# Altium schematic sheet projet_pcb_naked_f103.SchDoc
size A2
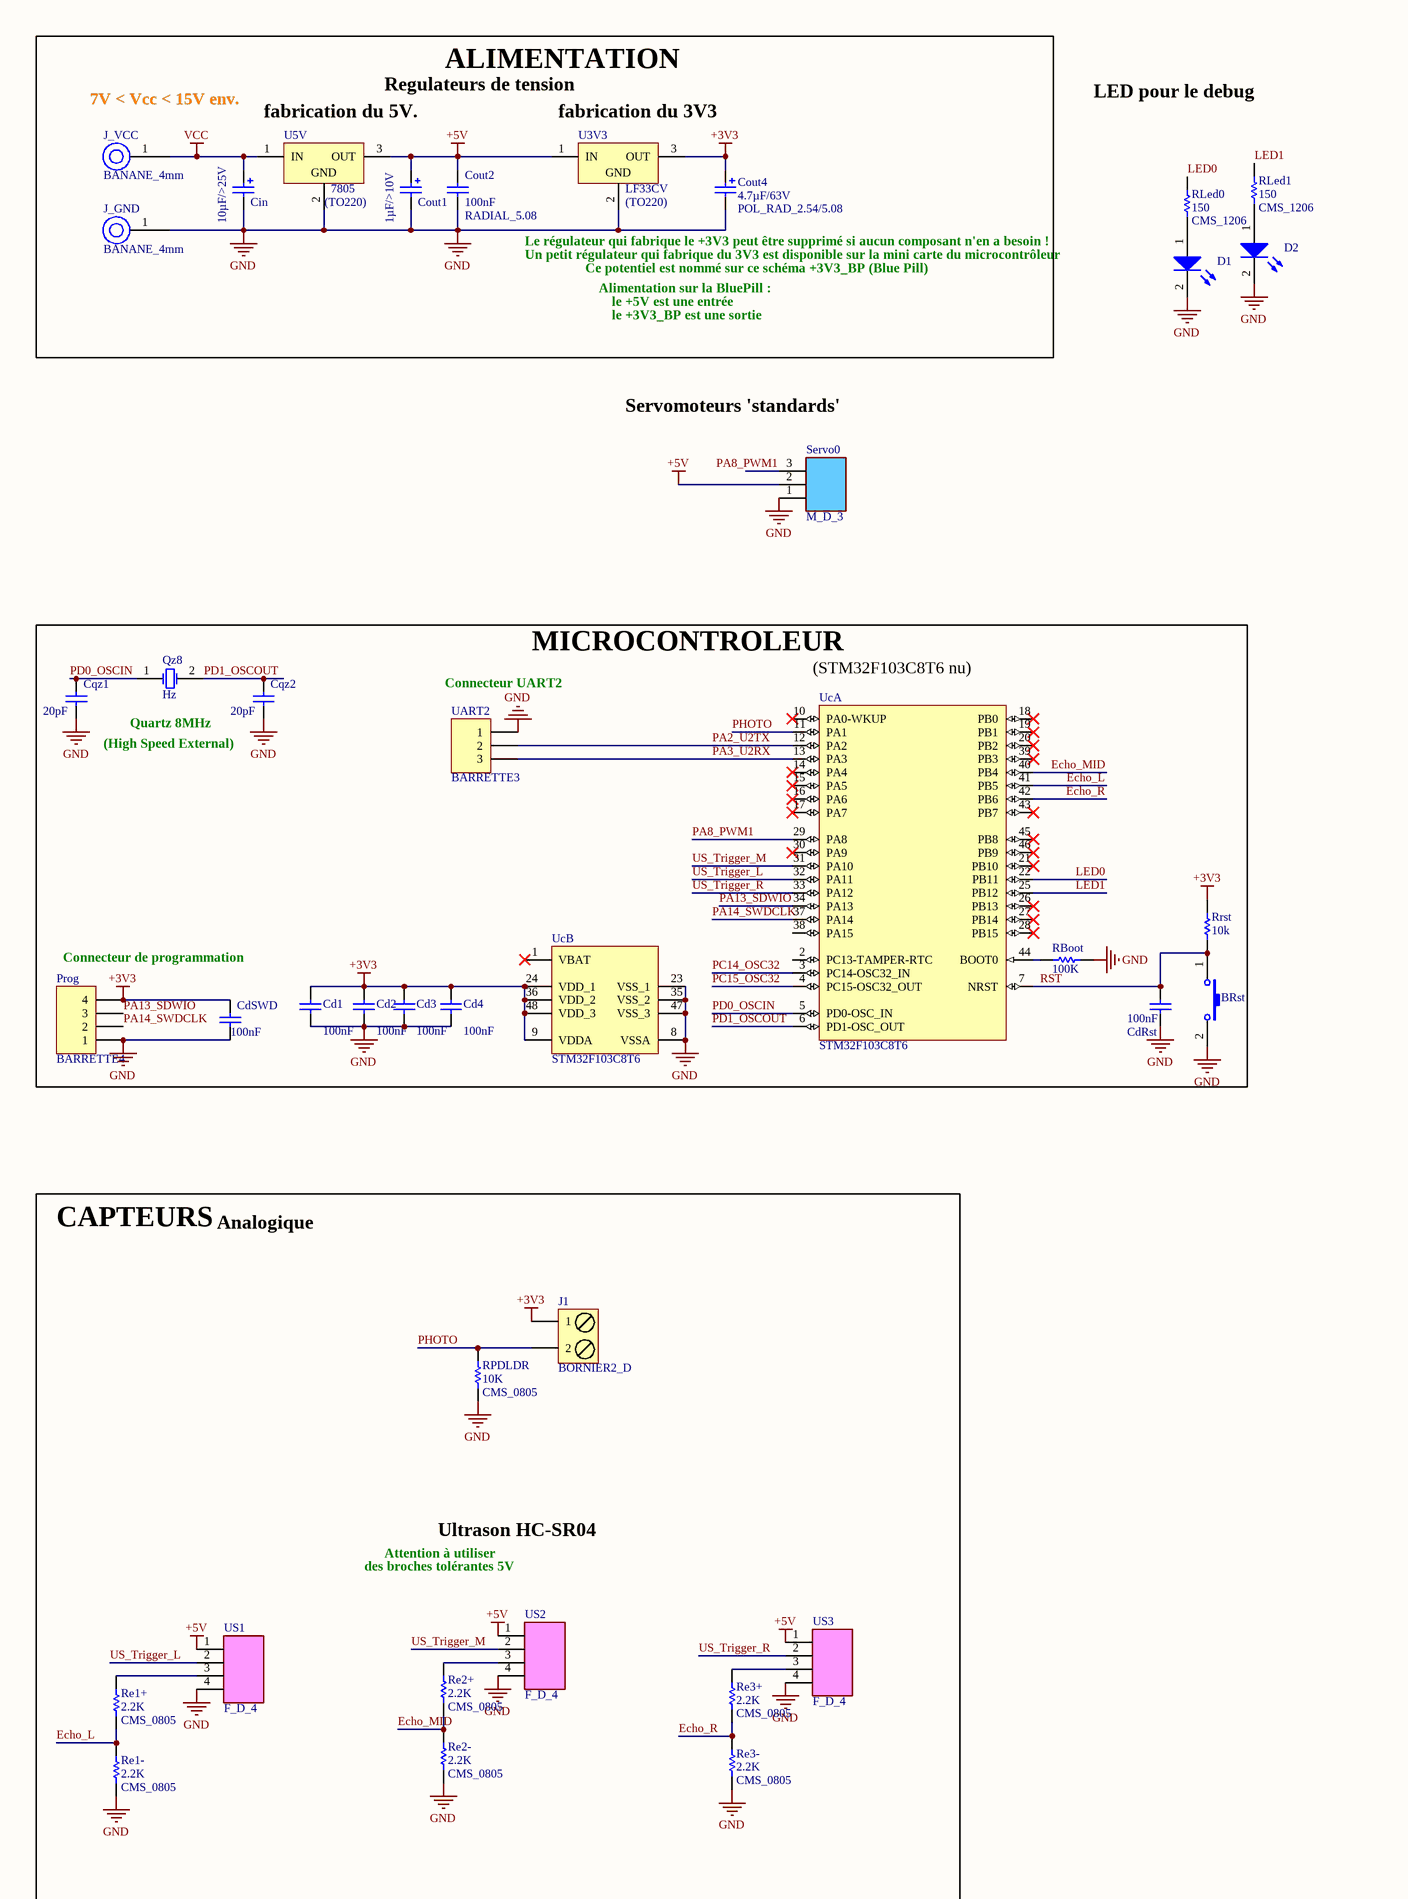
[diagram p0: projet_pcb_naked_f103.SchDoc, left]
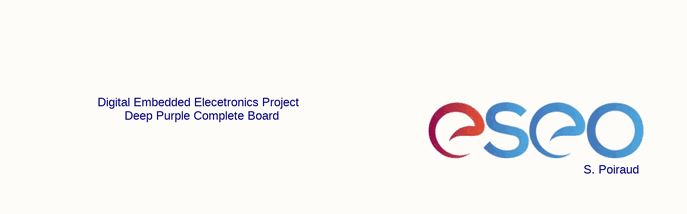
[diagram p1: projet_pcb_naked_f103.SchDoc, right]

## Parts
BRst  BOUTON_POUSSOIR_MINIATURE_TRAVERSANT  [BOUTON_POUSSE_PLAT_6x6]  (value not drawn)
Cd1  value 100nF  [CONDENSATEUR_CMS_0805]  (hidden comment: CMS_0805)
Cd2  value 100nF  [CONDENSATEUR_CMS_0805]  (hidden comment: CMS_0805)
Cd3  value 100nF  [CONDENSATEUR_CMS_0805]  (hidden comment: CMS_0805)
Cd4  value 100nF  [CONDENSATEUR_CMS_0805]  (hidden comment: CMS_0805)
CdRst  value 100nF  [C0805_N]  (hidden comment: Condensateur 0805)
CdSWD  value 100nF  [C0805_N]  (hidden comment: Condensateur 0805)
Cin  value 10µF/>25V  [CONDENSATEUR_POLARISE_ELECTROLYTIQUE_RADIAL_2.0/5.08]  (hidden comment: CONDENSATEUR_POL_ELECTROLY_RAD_2.0/5.08)
Cout1  value 1µF/>10V  [CONDENSATEUR_POLARISE_ELECTROLYTIQUE_RADIAL_2.0/5.08]  (hidden comment: CONDENSATEUR_POL_ELECTROLY_RAD_2.0/5.08)
Cout2  value 100nF  Type: RADIAL_5.08  [CONDENSATEUR_CERAMIQUE_RADIAL_5.08]  (hidden comment: CONDENSATEUR_CER_RAD_5.08)
Cout4  value 4.7µF/63V  Type: POL_RAD_2.54/5.08  [CONDENSATEUR_POLARISE_ELECTROLYTIQUE_RADIAL_2.54/5.08]  (hidden comment: CONDENSATEUR_POL_ELECTROLY_RAD_2.54/5.08)
Cqz1  value 20pF  [C0805_N]  (hidden comment: Condensateur 0805)
Cqz2  value 20pF  [C0805_N]  (hidden comment: Condensateur 0805)
D1  LED_CMS_0805  [LED_CMS_0805]  (value not drawn)
D2  LED_CMS_0805  [LED_CMS_0805]  (value not drawn)
J1  Type: BORNIER2_D  [BORNIER2_A_VIS]  (hidden comment: BORNIER2 DROIT A VIS)
J_GND  Type: BANANE_4mm  [DOUILLE_BANANE_4mm]  (hidden comment: DOUILLE BANANE 4mm)
J_VCC  Type: BANANE_4mm  [DOUILLE_BANANE_4mm]  (hidden comment: DOUILLE BANANE 4mm)
Prog  BARRETTE4  [HE14_4]
Qz8  Hz  [HC49/4H_SMX]
RBoot  value 100K  [RESISTANCE_CMS_0805]  (hidden comment: RESISTANCE_CMS_0805)
Re1+  value 2.2K  Type: CMS_0805  [RESISTANCE_CMS_0805]  (hidden comment: RESISTANCE_CMS_0805)
Re1-  value 2.2K  Type: CMS_0805  [RESISTANCE_CMS_0805]  (hidden comment: RESISTANCE_CMS_0805)
Re2+  value 2.2K  Type: CMS_0805  [RESISTANCE_CMS_0805]  (hidden comment: RESISTANCE_CMS_0805)
Re2-  value 2.2K  Type: CMS_0805  [RESISTANCE_CMS_0805]  (hidden comment: RESISTANCE_CMS_0805)
Re3+  value 2.2K  Type: CMS_0805  [RESISTANCE_CMS_0805]  (hidden comment: RESISTANCE_CMS_0805)
Re3-  value 2.2K  Type: CMS_0805  [RESISTANCE_CMS_0805]  (hidden comment: RESISTANCE_CMS_0805)
RLed0  value 150  Type: CMS_1206  [RESISTANCE_CMS_1206]  (hidden comment: RESISTANCE_CMS_1206)
RLed1  value 150  Type: CMS_1206  [RESISTANCE_CMS_1206]  (hidden comment: RESISTANCE_CMS_1206)
RPDLDR  value 10K  Type: CMS_0805  [RESISTANCE_CMS_0805]  (hidden comment: RESISTANCE_CMS_0805)
Rrst  10k  [R1206_N]
Servo0  Type: M_D_3  [BARRETTE_3_M_D]  (hidden comment: BARRETTE 3 CONTACTS 1 RANGEE MALE DROITE)
U3V3  Type: LF33CV  Package: (TO220)  [REGULATEUR_TO220_78XX]  (hidden comment: REGULATEUR_TO220_78XX)
U5V  Type: 7805  Package: (TO220)  [REGULATEUR_TO220_78XX]  (hidden comment: REGULATEUR_TO220_78XX)
UART2  BARRETTE3  [HDR1X3]
Uc  STM32F103C8T6  [STM-LQFP48_N]  (parts A,B of 2)
US1  Type: F_D_4  [BARRETTE_4_F_D]  (hidden comment: BARRETTE_4 CONTACTS_1 RANGEE_FEMELLE_DROITE)
US2  Type: F_D_4  [BARRETTE_4_F_D]  (hidden comment: BARRETTE_4 CONTACTS_1 RANGEE_FEMELLE_DROITE)
US3  Type: F_D_4  [BARRETTE_4_F_D]  (hidden comment: BARRETTE_4 CONTACTS_1 RANGEE_FEMELLE_DROITE)

## Blocks framed on the sheet
ALIMENTATION: Cin Cout1 Cout2 Cout4 J_GND J_VCC U3V3 U5V
MICROCONTROLEUR: BRst Cd1-Cd4 CdRst CdSWD Cqz1 Cqz2 Prog Qz8 RBoot Rrst UART2 Uc
CAPTEURS: J1 Re1+ Re1- Re2+ Re2- Re3+ Re3- RPDLDR US1-US3

## Nets
+3V3: Cd1.2 Cd2.2 Cd3.2 Cd4.2 CdSWD.2 Cout4.1 J1.1 Prog.4 Rrst.1 U3V3.3(OUT) Uc.9(VDDA) Uc.24(VDD_1) Uc.36(VDD_2) Uc.48(VDD_3)
+5V: Cout1.1 Cout2.2 Servo0.2 U3V3.1(IN) U5V.3(OUT) US1.1 US2.1 US3.1
GND: BRst.2 Cd1.1 Cd2.1 Cd3.1 Cd4.1 CdRst.1 CdSWD.1 Cin.2 Cout1.2 Cout2.1 Cout4.2 Cqz1.1 Cqz2.1 D1.2 D2.2 J_GND.1 Prog.1 RBoot.1 Re1-.1 Re2-.1 Re3-.1 RPDLDR.1 Servo0.1 U3V3.2(GND) U5V.2(GND) UART2.1 Uc.8(VSSA) Uc.23(VSS_1) Uc.35(VSS_2) Uc.47(VSS_3) US1.4 US2.4 US3.4
VCC: Cin.1 J_VCC.1 U5V.1(IN)
Echo_L: Re1+.1 Re1-.2 Uc.41(PB5)
Echo_MID: Re2+.1 Re2-.2 Uc.40(PB4)
Echo_R: Re3+.1 Re3-.2 Uc.42(PB6)
LED0: RLed0.2 Uc.22(PB11)
LED1: RLed1.2 Uc.25(PB12)
PA2_U2TX: UART2.2 Uc.12(PA2)
PA3_U2RX: UART2.3 Uc.13(PA3)
PA8_PWM1: Servo0.3 Uc.29(PA8)
PA13_SDWIO: Prog.3 Uc.34(PA13)
PA14_SWDCLK: Prog.2 Uc.37(PA14)
PC14_OSC32: Uc.3(PC14-OSC32_IN)
PC15_OSC32: Uc.4(PC15-OSC32_OUT)
PD0_OSCIN: Cqz1.2 Qz8.1(OSC1) Uc.5(PD0-OSC_IN)
PD1_OSCOUT: Cqz2.2 Qz8.2(OSC2) Uc.6(PD1-OSC_OUT)
PHOTO: J1.2 RPDLDR.2 Uc.11(PA1)
RST: BRst.1 CdRst.2 Rrst.2 Uc.7(NRST)
US_Trigger_L: Uc.32(PA11) US1.2
US_Trigger_M: Uc.31(PA10) US2.2
US_Trigger_R: Uc.33(PA12) US3.2
NetD1_1: D1.1 RLed0.1
NetD2_1: D2.1 RLed1.1
NetRBoot_2: RBoot.2 Uc.44(BOOT0)
NetRe1+_2: Re1+.2 US1.3
NetRe2+_2: Re2+.2 US2.3
NetRe3+_2: Re3+.2 US3.3

Not connected (* = marked no-connect by the designer): Uc 1(VBAT)* 2(PC13-TAMPER-RTC) 10(PA0-WKUP)* 14(PA4)* 15(PA5)* 16(PA6)* 17(PA7)* 18(PB0)* 19(PB1)* 20(PB2)* 21(PB10)* 26(PB13)* 27(PB14)* 28(PB15)* 30(PA9)* 38(PA15) 39(PB3)* 43(PB7)* 45(PB8)* 46(PB9)*

## Notes on the sheet
- 7V < Vcc < 15V env.
- Regulateurs de tension
- LED pour le debug
- (near U5V) fabrication du 5V.
- (near U3V3) fabrication du 3V3
- Le régulateur qui fabrique le +3V3 peut être supprimé si aucun composant n'en a besoin !
- Un petit régulateur qui fabrique du 3V3 est disponible sur la mini carte du microcontrôleur
- Ce potentiel est nommé sur ce schéma +3V3_BP (Blue Pill)
- Alimentation sur la BluePill :
- le +5V est une entrée
- le +3V3_BP est une sortie
- Servomoteurs 'standards'
- (near UART2) Connecteur UART2
- (near Uc) (STM32F103C8T6 nu)
- (High Speed External)
- Quartz 8MHz
- Connecteur de programmation
- Analogique
- des broches tolérantes 5V
- Attention à utiliser
- Ultrason HC-SR04
- Digital Embedded Elecetronics Project
- Deep Purple Complete Board
- S. Poiraud
- Title
- Size:
- Date:
- File:
- A2
- Number:
- Time:
- Revision:
- Sheet
- of

## Library data of the parts
BRst = BOUTON_POUSSOIR_MINIATURE_TRAVERSANT: BOUTON POUSSOIR MINIATURE TRAVERSANT ON/OFF; Type: B_POUSS_MINI_T
Cd1-Cd4 = CONDENSATEUR_CMS_CER_0805: CONDENSATEUR CMS CERAMIQUE 0805; Type: CMS_0805
CdRst CdSWD Cqz1 Cqz2 = CONDENSATEUR_CER_RAD_5.08: Type: RADIAL_5.08
Cin Cout1 = CONDENSATEUR_POL_ELECTROLY_RAD_2.0/5.08: CONDENSATEUR POLARISE ELECTROLYTIQUE RADIAL 2.0/5.08; Type: POL_RAD_2.0/5.08
Cout2 = CONDENSATEUR_CER_RAD_5.08: CONDENSATEUR TRAVERSANT CERAMIQUE RADIAL 5.08mm
Cout4 = CONDENSATEUR_POL_ELECTROLY_RAD_2.54/5.08: CONDENSATEUR POLARISE ELECTROLYTIQUE RADIAL 2.54/5.08
D1 D2 = LED_CMS_0805: LED CMS 0805; Type: CMS_0805
J1 = BORNIER2_DROIT_A VIS: BORNIER 2 PLOTS DROIT A VIS 5.08mm
J_GND J_VCC = DOUILLE_BANANE_4mm: DOUILLE BANANE 4 mm
Prog = BARRETTE4: Header, 4-Pin; LatestRevisionDate: 17-Jul-2002; LatestRevisionNote: Re-released for DXP Platform.; Publisher: Altium Limited
Qz8 = Quartz: Crystal Oscillator; Published: 8-Jun-2000; LatestRevisionDate: 17-Jul-2002; LatestRevisionNote: Re-released for DXP Platform.; PackageReference: R38; Publisher: Altium Limited
RBoot Re1+ Re1- Re2+ Re2- Re3+ Re3- RPDLDR = RESISTANCE_CMS_0805: RESISTANCE CMS 0805
  RBoot: Type: CMS_0805
RLed0 RLed1 = RESISTANCE_CMS_1206: RESISTANCE CMS 1206
Rrst = Resistor: Published: 8-Jun-2000; LatestRevisionDate: 17-Jul-2002; LatestRevisionNote: Re-released for DXP Platform.; PackageReference: AXIAL-0.5; Publisher: Altium Limited
Servo0 = BARRETTE_3 CONTACTS_1 RANGEE_MALE_DROITE
U3V3 U5V = REGULATEUR_TO220_78XX: REGULATEUR DE TENSION POSITIVE 78XX BOITIER TO220
UART2 = BARRETTE3: Header, 3-Pin; LatestRevisionDate: 17-Jul-2002; LatestRevisionNote: Re-released for DXP Platform.; Publisher: Altium Limited
Uc = STM32F103C8T6: ARM Cortex-M3 32-bit MCU, 64 KB Flash, 20 KB Internal RAM, 37 I/Os, 48-pin LQFP, -40 to 85 degC, Tray; A/D Converter: 2x12-bit (10 Channel); FLASH Size (Prog) (kB): 64; I/Os (High Current): 37; Internal RAM Size (kB): 20; Operating Frequency(F) (Processor speed) (MHz): 72; Supply Voltage(Vcc) min (V): 2; DatasheetVersion: Rev. 16; PackageVersion: Rev. 6, 06/2013; PackageReference: LQFP48; PackageDescription: 48-Pin Low Profile Quad Flat Package, 7 x 7 mm Body, 0.5 mm Pitch; Supplier 1: Digi-Key; Supplier Part Number 1: 497-6063-ND; Supplier 2: Farnell; Supplier Part Number 2: 1447637; Supplier 3: Newark; Supplier Part Number 3: 59M2182; Supplier 4: Newark; Supplier Part Number 4: 57P1222; Supplier 5: Mouser; Supplier Part Number 5: 511-STM32F103C8T6; Core: ARM Cortex-M3; Packing: Tray; Mounting Technology: Surface Mount; PartNumber: STM32F103C8T6; ComponentLink1Description: Manufacturer URL; ComponentLink1URL: http://www.st.com/web/en/home.html; ComponentLink2Description: Datasheet; ComponentLink2URL: http://www.st.com/st-web-ui/static/active/en/resource/technical/document/datasheet/CD00161566.pdf; ComponentLink3Description: Package Specification; ComponentLink3URL: http://www.st.com/st-web-ui/static/active/en/resource/technical/document/datasheet/DM00058181.pdf
US1-US3 = BARRETTE_4 CONTACTS_1 RANGEE_FEMELLE_DROITE: BARRETTE 4 CONTACTS 1 RANGEE FEMELLE DROITE